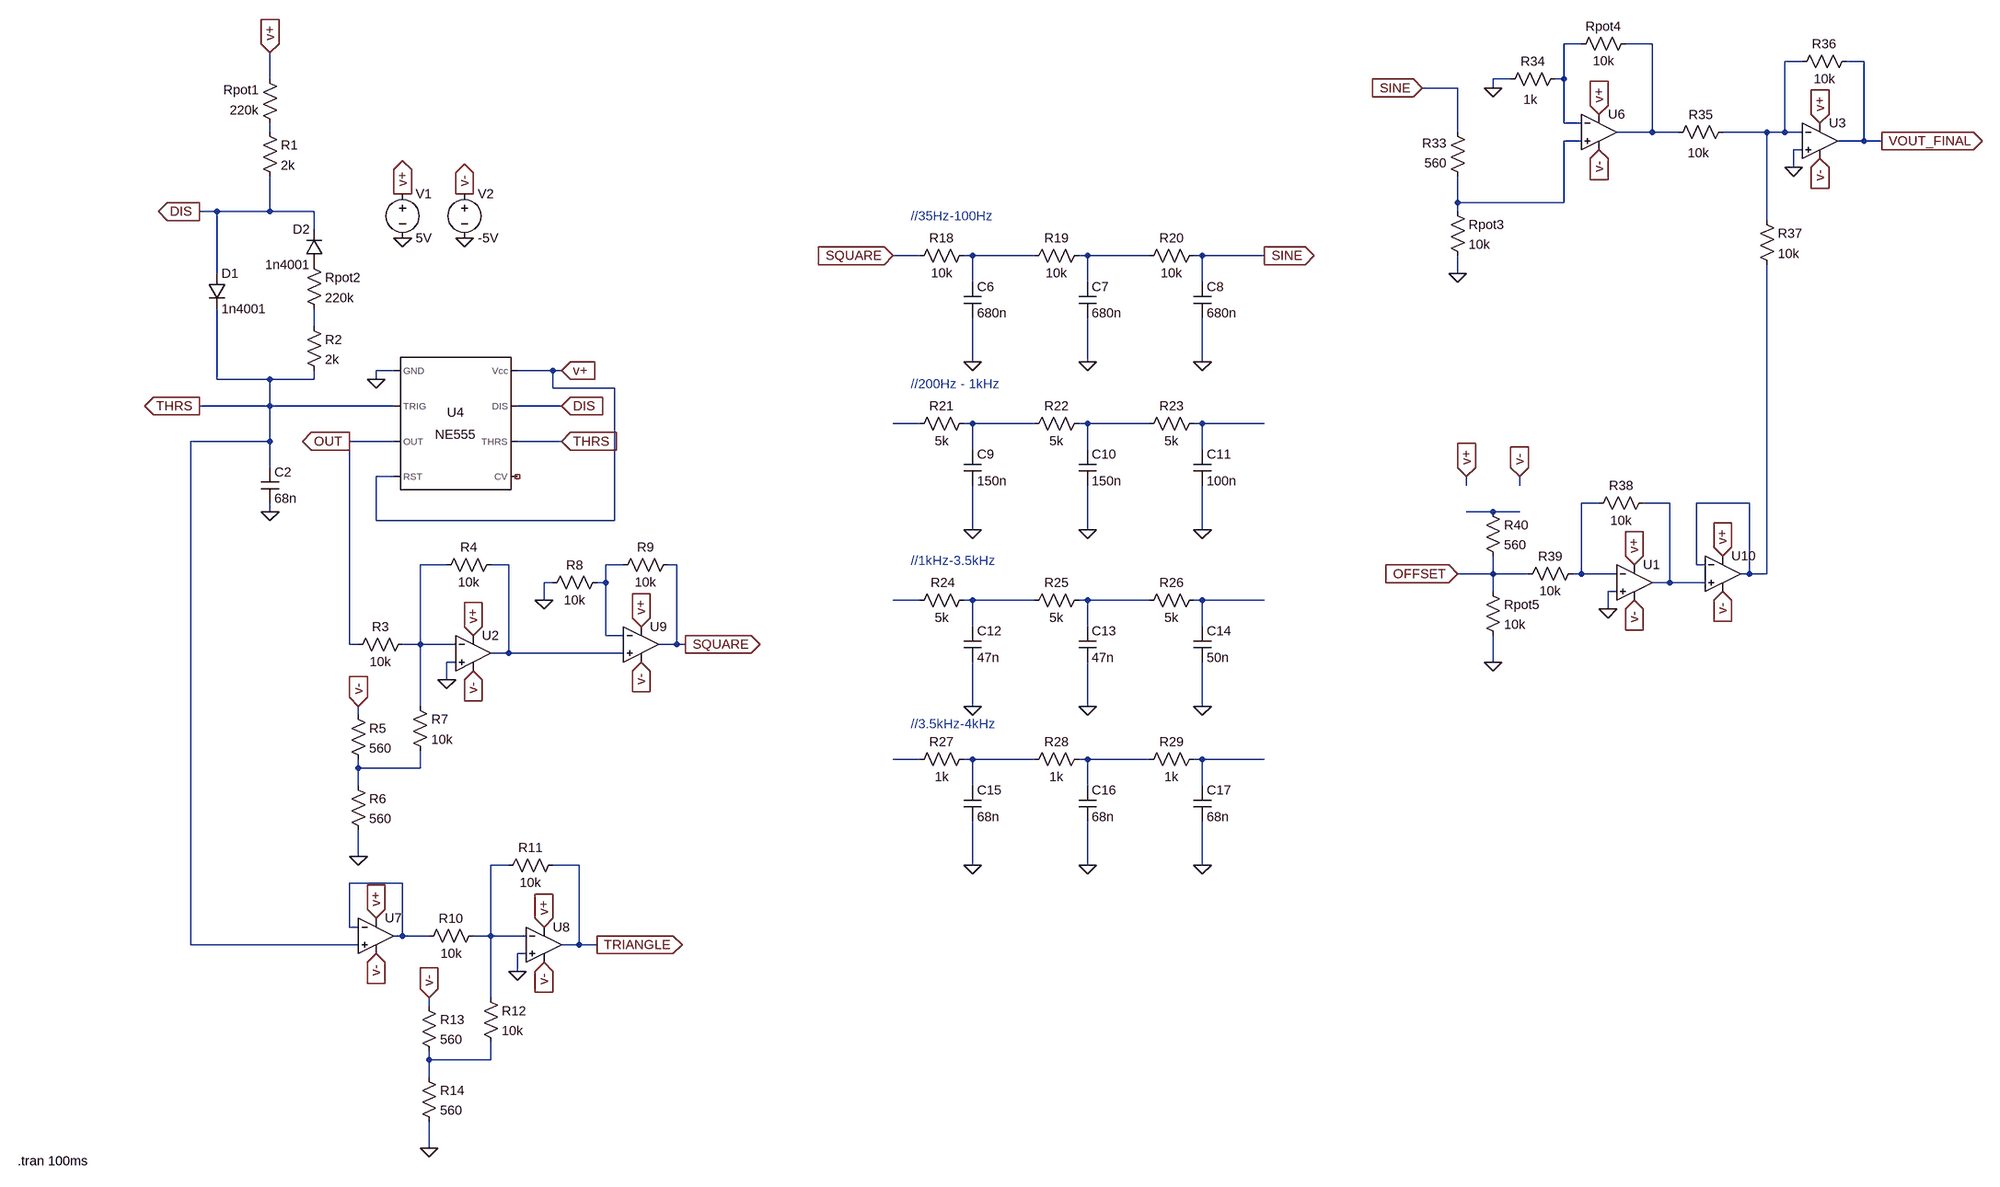
[diagram p0: schematic realna sema.asc]
realna sema.asc, the LTspice schematic file:
Version 4
SHEET 1 3212 2508
WIRE 1088 -464 1056 -464
WIRE 1216 -464 1168 -464
WIRE 1488 -432 1456 -432
WIRE 1600 -432 1568 -432
WIRE -1360 -400 -1360 -448
WIRE 960 -400 928 -400
WIRE 1056 -400 1056 -464
WIRE 1056 -400 1040 -400
WIRE 864 -384 800 -384
WIRE 928 -384 928 -400
WIRE 1056 -320 1056 -400
WIRE 1088 -320 1056 -320
WIRE -1360 -304 -1360 -320
WIRE 864 -304 864 -384
WIRE 1216 -304 1216 -464
WIRE 1216 -304 1152 -304
WIRE 1264 -304 1216 -304
WIRE 1424 -304 1344 -304
WIRE 1456 -304 1456 -432
WIRE 1456 -304 1424 -304
WIRE 1488 -304 1456 -304
WIRE 1088 -288 1056 -288
WIRE 1600 -288 1600 -432
WIRE 1600 -288 1552 -288
WIRE 1632 -288 1600 -288
WIRE 1488 -272 1472 -272
WIRE 1472 -240 1472 -272
WIRE 864 -176 864 -224
WIRE 1056 -176 1056 -288
WIRE 1056 -176 864 -176
WIRE -1456 -160 -1488 -160
WIRE -1360 -160 -1360 -224
WIRE -1360 -160 -1456 -160
WIRE -1280 -160 -1360 -160
WIRE 864 -160 864 -176
WIRE 1424 -144 1424 -304
WIRE -1280 -128 -1280 -160
WIRE -112 -80 -160 -80
WIRE -16 -80 -32 -80
WIRE 96 -80 -16 -80
WIRE 192 -80 176 -80
WIRE 304 -80 192 -80
WIRE 400 -80 384 -80
WIRE 512 -80 400 -80
WIRE -1456 -48 -1456 -160
WIRE 864 -48 864 -80
WIRE -16 -32 -16 -80
WIRE 192 -32 192 -80
WIRE 400 -32 400 -80
WIRE -1280 48 -1280 16
WIRE -16 112 -16 32
WIRE 192 112 192 32
WIRE 400 112 400 32
WIRE -1136 128 -1168 128
WIRE -848 128 -912 128
WIRE -832 128 -848 128
WIRE -1456 144 -1456 16
WIRE -1360 144 -1456 144
WIRE -1280 144 -1280 128
WIRE -1280 144 -1360 144
WIRE -1168 144 -1168 128
WIRE -848 160 -848 128
WIRE -736 160 -848 160
WIRE -1360 192 -1360 144
WIRE -1360 192 -1488 192
WIRE -1136 192 -1360 192
WIRE -832 192 -912 192
WIRE -112 224 -160 224
WIRE -16 224 -32 224
WIRE 96 224 -16 224
WIRE 192 224 176 224
WIRE 304 224 192 224
WIRE 400 224 384 224
WIRE 512 224 400 224
WIRE -1360 256 -1360 192
WIRE -1360 256 -1504 256
WIRE -1136 256 -1216 256
WIRE -832 256 -912 256
WIRE -16 272 -16 224
WIRE 192 272 192 224
WIRE 400 272 400 224
WIRE -1360 304 -1360 256
WIRE -1136 320 -1168 320
WIRE 880 336 880 320
WIRE 976 336 976 320
WIRE 1120 368 1088 368
WIRE 1248 368 1200 368
WIRE 1392 368 1296 368
WIRE -1360 384 -1360 368
WIRE 928 384 880 384
WIRE 976 384 928 384
WIRE -1168 400 -1168 320
WIRE -736 400 -736 160
WIRE -736 400 -1168 400
WIRE -16 416 -16 336
WIRE 192 416 192 336
WIRE 400 416 400 336
WIRE -1040 480 -1088 480
WIRE -928 480 -960 480
WIRE -720 480 -752 480
WIRE -624 480 -640 480
WIRE 1296 480 1296 368
WIRE 1312 480 1296 480
WIRE 928 496 928 464
WIRE 928 496 864 496
WIRE 992 496 928 496
WIRE 1088 496 1088 368
WIRE 1088 496 1072 496
WIRE 1152 496 1088 496
WIRE 1392 496 1392 368
WIRE 1392 496 1376 496
WIRE 1424 496 1424 -64
WIRE 1424 496 1392 496
WIRE -848 512 -864 512
WIRE -752 512 -752 480
WIRE -752 512 -768 512
WIRE 1248 512 1248 368
WIRE 1248 512 1216 512
WIRE 1312 512 1248 512
WIRE 928 528 928 496
WIRE 1152 528 1136 528
WIRE -864 544 -864 512
WIRE -112 544 -160 544
WIRE -16 544 -32 544
WIRE 96 544 -16 544
WIRE 192 544 176 544
WIRE 304 544 192 544
WIRE 400 544 384 544
WIRE 512 544 400 544
WIRE 1136 560 1136 528
WIRE -16 592 -16 544
WIRE 192 592 192 544
WIRE 400 592 400 544
WIRE -752 608 -752 512
WIRE -720 608 -752 608
WIRE -1216 624 -1216 256
WIRE -1200 624 -1216 624
WIRE -1088 624 -1088 480
WIRE -1088 624 -1120 624
WIRE -1024 624 -1088 624
WIRE -624 624 -624 480
WIRE -624 624 -656 624
WIRE -608 624 -624 624
WIRE -928 640 -928 480
WIRE -928 640 -960 640
WIRE -720 640 -928 640
WIRE -1024 656 -1040 656
WIRE 928 656 928 608
WIRE -1040 688 -1040 656
WIRE -1088 736 -1088 624
WIRE -16 736 -16 656
WIRE 192 736 192 656
WIRE 400 736 400 656
WIRE -1200 752 -1200 736
WIRE -112 832 -160 832
WIRE -16 832 -32 832
WIRE 96 832 -16 832
WIRE 192 832 176 832
WIRE 304 832 192 832
WIRE 400 832 384 832
WIRE 512 832 400 832
WIRE -1200 848 -1200 832
WIRE -1088 848 -1088 816
WIRE -1088 848 -1200 848
WIRE -1200 880 -1200 848
WIRE -16 880 -16 832
WIRE 192 880 192 832
WIRE 400 880 400 832
WIRE -1200 1008 -1200 960
WIRE -928 1024 -960 1024
WIRE -800 1024 -848 1024
WIRE -16 1024 -16 944
WIRE 192 1024 192 944
WIRE 400 1024 400 944
WIRE -1120 1056 -1216 1056
WIRE -1216 1136 -1216 1056
WIRE -1200 1136 -1216 1136
WIRE -1120 1152 -1120 1056
WIRE -1120 1152 -1136 1152
WIRE -1072 1152 -1120 1152
WIRE -960 1152 -960 1024
WIRE -960 1152 -992 1152
WIRE -896 1152 -960 1152
WIRE -1504 1168 -1504 256
WIRE -1200 1168 -1504 1168
WIRE -800 1168 -800 1024
WIRE -800 1168 -832 1168
WIRE -768 1168 -800 1168
WIRE -896 1184 -912 1184
WIRE -912 1216 -912 1184
WIRE -960 1264 -960 1152
WIRE -1072 1280 -1072 1264
WIRE -1072 1376 -1072 1360
WIRE -960 1376 -960 1344
WIRE -960 1376 -1072 1376
WIRE -1072 1408 -1072 1376
WIRE -1072 1536 -1072 1488
FLAG -1120 -112 0
FLAG -1120 -192 v+
IOPIN -1120 -192 Out
FLAG 1632 -288 VOUT_FINAL
IOPIN 1632 -288 Out
FLAG -832 256 THRS
IOPIN -832 256 In
FLAG -1488 192 THRS
IOPIN -1488 192 Out
FLAG -832 192 DIS
IOPIN -832 192 In
FLAG -832 128 v+
IOPIN -832 128 In
FLAG -1008 -112 0
FLAG -1008 -192 v-
IOPIN -1008 -192 Out
FLAG 928 -384 0
FLAG 1520 -320 v+
IOPIN 1520 -320 In
FLAG 1520 -256 v-
IOPIN 1520 -256 In
FLAG 880 320 v+
IOPIN 880 320 In
FLAG 928 656 0
FLAG 864 496 OFFSET
IOPIN 864 496 In
FLAG 864 -48 0
FLAG 976 320 v-
IOPIN 976 320 In
FLAG 192 1024 0
FLAG 400 1024 0
FLAG -16 736 0
FLAG 192 736 0
FLAG 400 736 0
FLAG -16 112 0
FLAG 192 112 0
FLAG 400 112 0
FLAG -768 1168 TRIANGLE
IOPIN -768 1168 Out
FLAG -1488 -160 DIS
IOPIN -1488 -160 Out
FLAG -16 1024 0
FLAG -1360 384 0
FLAG -1360 -448 v+
IOPIN -1360 -448 In
FLAG 1120 -336 v+
IOPIN 1120 -336 In
FLAG 1120 -272 v-
IOPIN 1120 -272 In
FLAG -1168 144 0
FLAG 1472 -240 0
FLAG -992 608 v+
IOPIN -992 608 In
FLAG -992 672 v-
IOPIN -992 672 In
FLAG -1040 688 0
FLAG -1200 736 v-
IOPIN -1200 736 In
FLAG -1200 1008 0
FLAG -1168 1120 v+
IOPIN -1168 1120 In
FLAG -1168 1184 v-
IOPIN -1168 1184 In
FLAG -864 1136 v+
IOPIN -864 1136 In
FLAG -864 1200 v-
IOPIN -864 1200 In
FLAG -912 1216 0
FLAG -1072 1264 v-
IOPIN -1072 1264 In
FLAG -1072 1536 0
FLAG -608 624 SQUARE
IOPIN -608 624 Out
FLAG 800 -384 SINE
IOPIN 800 -384 In
FLAG -688 592 v+
IOPIN -688 592 In
FLAG -688 656 v-
IOPIN -688 656 In
FLAG -16 416 0
FLAG 192 416 0
FLAG 400 416 0
FLAG -864 544 0
FLAG 1184 480 v+
IOPIN 1184 480 In
FLAG 1184 544 v-
IOPIN 1184 544 In
FLAG 1136 560 0
FLAG 1344 464 v+
IOPIN 1344 464 In
FLAG 1344 528 v-
IOPIN 1344 528 In
FLAG 512 -80 SINE
IOPIN 512 -80 Out
FLAG -160 -80 SQUARE
IOPIN -160 -80 In
FLAG -1216 256 OUT
IOPIN -1216 256 Out
SYMBOL voltage -1120 -208 R0
WINDOW 123 0 0 Left 0
WINDOW 39 0 0 Left 0
SYMATTR InstName V1
SYMATTR Value 5V
SYMBOL res 1184 -480 R90
WINDOW 0 0 56 VBottom 2
WINDOW 3 32 56 VTop 2
SYMATTR InstName Rpot4
SYMATTR Value 10k
SYMBOL res 1056 -416 R90
WINDOW 0 0 56 VBottom 2
WINDOW 3 38 60 VTop 2
SYMATTR InstName R34
SYMATTR Value 1k
SYMBOL Misc\\NE555 -1024 224 R0
SYMATTR InstName U4
SYMBOL cap -1376 304 R0
SYMATTR InstName C2
SYMATTR Value 68n
SYMBOL res -1296 -80 R0
SYMATTR InstName Rpot2
SYMATTR Value 220k
SYMBOL voltage -1008 -208 R0
WINDOW 123 0 0 Left 0
WINDOW 39 0 0 Left 0
SYMATTR InstName V2
SYMATTR Value -5V
SYMBOL OpAmps\\UniversalOpAmp2 1520 -288 R0
SYMATTR InstName U3
SYMBOL res 1360 -320 R90
WINDOW 0 0 56 VBottom 2
WINDOW 3 38 60 VTop 2
SYMATTR InstName R35
SYMATTR Value 10k
SYMBOL res 912 512 R0
SYMATTR InstName Rpot5
SYMATTR Value 10k
SYMBOL res 912 368 R0
SYMATTR InstName R40
SYMATTR Value 560
SYMBOL res 880 -208 R180
WINDOW 0 36 76 Left 2
WINDOW 3 36 40 Left 2
SYMATTR InstName R33
SYMATTR Value 560
SYMBOL res 848 -176 R0
SYMATTR InstName Rpot3
SYMATTR Value 10k
SYMBOL res -16 816 R90
WINDOW 0 0 56 VBottom 2
WINDOW 3 32 56 VTop 2
SYMATTR InstName R27
SYMATTR Value 1k
SYMBOL cap -32 880 R0
SYMATTR InstName C15
SYMATTR Value 68n
SYMBOL res -1344 -304 R180
WINDOW 0 36 76 Left 2
WINDOW 3 36 40 Left 2
SYMATTR InstName Rpot1
SYMATTR Value 220k
SYMBOL cap -32 592 R0
SYMATTR InstName C12
SYMATTR Value 47n
SYMBOL res -16 -96 R90
WINDOW 0 0 56 VBottom 2
WINDOW 3 32 56 VTop 2
SYMATTR InstName R18
SYMATTR Value 10k
SYMBOL cap -32 -32 R0
SYMATTR InstName C6
SYMATTR Value 680n
SYMBOL cap 176 -32 R0
SYMATTR InstName C7
SYMATTR Value 680n
SYMBOL cap 384 -32 R0
SYMATTR InstName C8
SYMATTR Value 680n
SYMBOL res 192 -96 R90
WINDOW 0 0 56 VBottom 2
WINDOW 3 32 56 VTop 2
SYMATTR InstName R19
SYMATTR Value 10k
SYMBOL res 400 -96 R90
WINDOW 0 0 56 VBottom 2
WINDOW 3 32 56 VTop 2
SYMATTR InstName R20
SYMATTR Value 10k
SYMBOL res 192 816 R90
WINDOW 0 0 56 VBottom 2
WINDOW 3 32 56 VTop 2
SYMATTR InstName R28
SYMATTR Value 1k
SYMBOL res 400 816 R90
WINDOW 0 0 56 VBottom 2
WINDOW 3 32 56 VTop 2
SYMATTR InstName R29
SYMATTR Value 1k
SYMBOL res 192 528 R90
WINDOW 0 0 56 VBottom 2
WINDOW 3 32 56 VTop 2
SYMATTR InstName R25
SYMATTR Value 5k
SYMBOL res 400 528 R90
WINDOW 0 0 56 VBottom 2
WINDOW 3 32 56 VTop 2
SYMATTR InstName R26
SYMATTR Value 5k
SYMBOL cap 176 592 R0
SYMATTR InstName C13
SYMATTR Value 47n
SYMBOL cap 384 592 R0
SYMATTR InstName C14
SYMATTR Value 50n
SYMBOL cap 176 880 R0
SYMATTR InstName C16
SYMATTR Value 68n
SYMBOL cap 384 880 R0
SYMATTR InstName C17
SYMATTR Value 68n
SYMBOL res -16 528 R90
WINDOW 0 0 54 VBottom 2
WINDOW 3 32 56 VTop 2
SYMATTR InstName R24
SYMATTR Value 5k
SYMBOL res 1408 -160 R0
SYMATTR InstName R37
SYMATTR Value 10k
SYMBOL OpAmps\\UniversalOpAmp2 1120 -304 R0
SYMATTR InstName U6
SYMBOL res 1472 -416 R270
WINDOW 0 32 56 VTop 2
WINDOW 3 0 56 VBottom 2
SYMATTR InstName R36
SYMATTR Value 10k
SYMBOL OpAmps\\UniversalOpAmp2 -992 640 R0
SYMATTR InstName U2
SYMBOL res -1104 608 R90
WINDOW 0 0 56 VBottom 2
WINDOW 3 32 56 VTop 2
SYMATTR InstName R3
SYMATTR Value 10k
SYMBOL res -944 464 R90
WINDOW 0 0 56 VBottom 2
WINDOW 3 32 56 VTop 2
SYMATTR InstName R4
SYMATTR Value 10k
SYMBOL res -1104 720 R0
SYMATTR InstName R7
SYMATTR Value 10k
SYMBOL res -1216 864 R0
SYMATTR InstName R6
SYMATTR Value 560
SYMBOL res -1216 736 R0
SYMATTR InstName R5
SYMATTR Value 560
SYMBOL OpAmps\\UniversalOpAmp2 -1168 1152 R0
SYMATTR InstName U7
SYMBOL OpAmps\\UniversalOpAmp2 -864 1168 R0
SYMATTR InstName U8
SYMBOL res -976 1136 R90
WINDOW 0 0 56 VBottom 2
WINDOW 3 32 56 VTop 2
SYMATTR InstName R10
SYMATTR Value 10k
SYMBOL res -832 1008 R90
WINDOW 0 0 56 VBottom 2
WINDOW 3 32 56 VTop 2
SYMATTR InstName R11
SYMATTR Value 10k
SYMBOL res -976 1248 R0
SYMATTR InstName R12
SYMATTR Value 10k
SYMBOL res -1088 1392 R0
SYMATTR InstName R14
SYMATTR Value 560
SYMBOL res -1088 1264 R0
SYMATTR InstName R13
SYMATTR Value 560
SYMBOL diode -1472 -48 R0
SYMATTR InstName D1
SYMATTR Value 1n4001
SYMBOL diode -1264 -64 R180
WINDOW 0 24 64 Left 2
WINDOW 3 24 0 Left 2
SYMATTR InstName D2
SYMATTR Value 1n4001
SYMBOL res -1376 -320 R0
SYMATTR InstName R1
SYMATTR Value 2k
SYMBOL res -1296 32 R0
SYMATTR InstName R2
SYMATTR Value 2k
SYMBOL OpAmps\\UniversalOpAmp2 -688 624 R0
SYMATTR InstName U9
SYMBOL res -624 464 R90
WINDOW 0 0 56 VBottom 2
WINDOW 3 32 56 VTop 2
SYMATTR InstName R9
SYMATTR Value 10k
SYMBOL res -16 208 R90
WINDOW 0 0 56 VBottom 2
WINDOW 3 32 56 VTop 2
SYMATTR InstName R21
SYMATTR Value 5k
SYMBOL cap -32 272 R0
SYMATTR InstName C9
SYMATTR Value 150n
SYMBOL res 192 208 R90
WINDOW 0 0 56 VBottom 2
WINDOW 3 32 56 VTop 2
SYMATTR InstName R22
SYMATTR Value 5k
SYMBOL cap 176 272 R0
SYMATTR InstName C10
SYMATTR Value 150n
SYMBOL res 400 208 R90
WINDOW 0 0 56 VBottom 2
WINDOW 3 32 56 VTop 2
SYMATTR InstName R23
SYMATTR Value 5k
SYMBOL cap 384 272 R0
SYMATTR InstName C11
SYMATTR Value 100n
SYMBOL res -752 496 R90
WINDOW 0 0 56 VBottom 2
WINDOW 3 32 56 VTop 2
SYMATTR InstName R8
SYMATTR Value 10k
SYMBOL OpAmps\\UniversalOpAmp2 1184 512 R0
SYMATTR InstName U1
SYMBOL res 1088 480 R90
WINDOW 0 0 56 VBottom 2
WINDOW 3 32 56 VTop 2
SYMATTR InstName R39
SYMATTR Value 10k
SYMBOL res 1216 352 R90
WINDOW 0 0 56 VBottom 2
WINDOW 3 32 56 VTop 2
SYMATTR InstName R38
SYMATTR Value 10k
SYMBOL OpAmps\\UniversalOpAmp2 1344 496 R0
SYMATTR InstName U10
TEXT -128 -152 Left 2 ;//35Hz-100Hz
TEXT -128 472 Left 2 ;//1kHz-3.5kHz
TEXT -128 768 Left 2 ;//3.5kHz-4kHz
TEXT -128 152 Left 2 ;//200Hz - 1kHz
TEXT -2152 1560 Left 2 !.tran 100ms

The netlist it stands for:
* realna sema.asc
V1 v+ 0 5V
Rpot4 N002 N001 10k
R34 N001 0 1k
XU4 0 THRS OUT v+ NC_01 THRS DIS v+ NE555  ; pins GND TRIG OUT RST CV THRS DIS Vcc
C2 THRS 0 68n
Rpot2 P001 N008 220k
V2 v- 0 -5V
XU3 0 N003 v+ v- VOUT_FINAL level2 Avol=1Meg GBW=10Meg Slew=10Meg Ilimit=25m Rail=0 Vos=0 En=0 Enk=0 In=0 Ink=0 Rin=500Meg  ; pins In+ In- V+ V- OUT
R35 N003 N002 10k
Rpot5 OFFSET 0 10k
R40 N016 OFFSET 560
R33 N005 SINE 560
Rpot3 N005 0 10k
R27 N025 N024 1k
C15 N025 0 68n
Rpot1 N004 v+ 220k
C12 N021 0 47n
R18 N006 SQUARE 10k
C6 N006 0 680n
C7 N007 0 680n
C8 SINE 0 680n
R19 N007 N006 10k
R20 SINE N007 10k
R28 N026 N025 1k
R29 N027 N026 1k
R25 N022 N021 5k
R26 N023 N022 5k
C13 N022 0 47n
C14 N023 0 50n
C16 N026 0 68n
C17 N027 0 68n
R24 N021 N020 5k
R37 N003 N015 10k
XU6 N005 N001 v+ v- N002 level2 Avol=1Meg GBW=10Meg Slew=10Meg Ilimit=25m Rail=0 Vos=0 En=0 Enk=0 In=0 Ink=0 Rin=500Meg  ; pins In+ In- V+ V- OUT
R36 N003 VOUT_FINAL 10k
XU2 0 N017 v+ v- N018 level2 Avol=1Meg GBW=10Meg Slew=10Meg Ilimit=25m Rail=0 Vos=0 En=0 Enk=0 In=0 Ink=0 Rin=500Meg  ; pins In+ In- V+ V- OUT
R3 N017 OUT 10k
R4 N018 N017 10k
R7 N017 N028 10k
R6 N028 0 560
R5 v- N028 560
XU7 THRS N030 v+ v- N030 level2 Avol=1Meg GBW=10Meg Slew=10Meg Ilimit=25m Rail=0 Vos=0 En=0 Enk=0 In=0 Ink=0 Rin=500Meg  ; pins In+ In- V+ V- OUT
XU8 0 N029 v+ v- TRIANGLE level2 Avol=1Meg GBW=10Meg Slew=10Meg Ilimit=25m Rail=0 Vos=0 En=0 Enk=0 In=0 Ink=0 Rin=500Meg  ; pins In+ In- V+ V- OUT
R10 N029 N030 10k
R11 TRIANGLE N029 10k
R12 N029 N031 10k
R14 N031 0 560
R13 v- N031 560
D1 DIS THRS 1n4001
D2 P001 DIS 1n4001
R1 N004 DIS 2k
R2 N008 THRS 2k
XU9 N018 N019 v+ v- SQUARE level2 Avol=1Meg GBW=10Meg Slew=10Meg Ilimit=25m Rail=0 Vos=0 En=0 Enk=0 In=0 Ink=0 Rin=500Meg  ; pins In+ In- V+ V- OUT
R9 SQUARE N019 10k
R21 N010 N009 5k
C9 N010 0 150n
R22 N011 N010 5k
C10 N011 0 150n
R23 N012 N011 5k
C11 N012 0 100n
R8 N019 0 10k
XU1 0 N013 v+ v- N014 level2 Avol=1Meg GBW=10Meg Slew=10Meg Ilimit=25m Rail=0 Vos=0 En=0 Enk=0 In=0 Ink=0 Rin=500Meg  ; pins In+ In- V+ V- OUT
R39 N013 OFFSET 10k
R38 N014 N013 10k
XU10 N014 N015 v+ v- N015 level2 Avol=1Meg GBW=10Meg Slew=10Meg Ilimit=25m Rail=0 Vos=0 En=0 Enk=0 In=0 Ink=0 Rin=500Meg  ; pins In+ In- V+ V- OUT
.model D D
.lib standard.dio
* //35Hz-100Hz
* //1kHz-3.5kHz
* //3.5kHz-4kHz
* //200Hz - 1kHz
.tran 100ms
.lib NE555.sub
.lib UniversalOpAmp2.lib
.backanno
.end